# Altium schematic sheet DPPXHK_10CL010_POWER.SchDoc
size A4
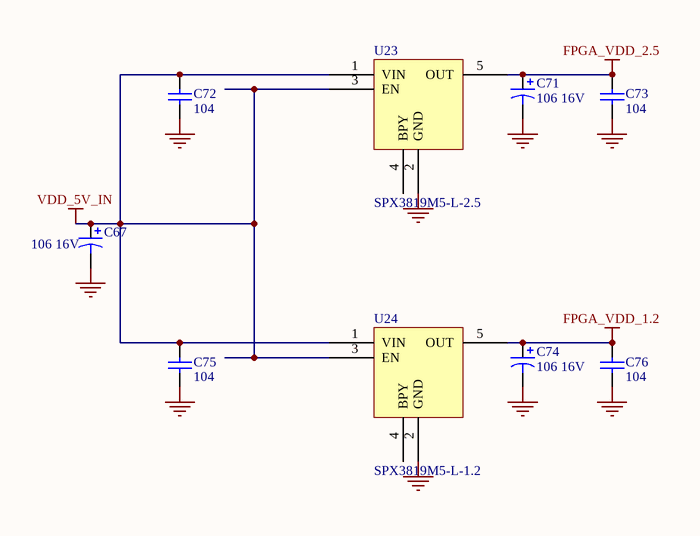
[diagram p0: DPPXHK_10CL010_POWER.SchDoc]

## Parts
C67  106 16V  [LC0402]
C71  106 16V  [LC0402]
C72  104  [LC0402]
C73  104  [LC0402]
C74  106 16V  [LC0402]
C75  104  [LC0402]
C76  104  [LC0402]
U23  SPX3819M5-L-2.5  [SOT-23-5]
U24  SPX3819M5-L-1.2  [SOT-23-5]

## Nets
FPGA_VDD_1.2: C74.1 C76.2 U24.5(OUT)
FPGA_VDD_2.5: C71.1 C73.2 U23.5(OUT)
GND: C67.2 C71.2 C72.1 C73.1 C74.2 C75.1 C76.1 U23.2(GND) U24.2(GND)
VDD_5V_IN: C67.1 C72.2 C75.2 U23.1(VIN) U23.3(EN) U24.1(VIN) U24.3(EN)

Not connected (* = marked no-connect by the designer): U23 4(BPY); U24 4(BPY)

## Library data of the parts
C67 C71 C74 = Cap Pol3: Polarized Capacitor (Surface Mount); Published: 8-Jun-2000; LatestRevisionDate: 17-Jul-2002; LatestRevisionNote: Re-released for DXP Platform.; PackageReference: C0805; Publisher: Altium Limited
C72 C73 C75 C76 = Cap Semi: Capacitor (Semiconductor SIM Model); Published: 8-Jun-2000; LatestRevisionDate: 17-Jul-2002; LatestRevisionNote: Re-released for DXP Platform.; PackageReference: C1206; Publisher: Altium Limited
U23 U24 = SPX3819